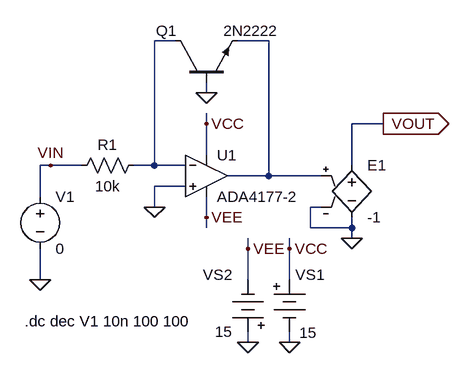
[diagram p0: schematic fig-01-03-21.asc]
fig-01-03-21.asc, the LTspice schematic file:
Version 4
SHEET 1 880 680
WIRE 160 -32 128 -32
WIRE 304 -32 256 -32
WIRE 208 48 208 32
WIRE 208 96 208 80
WIRE 480 96 432 96
WIRE 208 144 208 96
WIRE -32 160 -48 160
WIRE 16 160 -32 160
WIRE 128 160 128 -32
WIRE 128 160 96 160
WIRE 176 160 128 160
WIRE 432 160 432 96
WIRE 304 176 304 -32
WIRE 304 176 240 176
WIRE 384 176 304 176
WIRE 176 192 128 192
WIRE -48 208 -48 160
WIRE 128 224 128 192
WIRE 384 224 368 224
WIRE 208 240 208 208
WIRE 208 256 208 240
WIRE 368 256 368 224
WIRE 432 256 432 240
WIRE 432 256 368 256
WIRE 432 272 432 256
WIRE 272 288 272 272
WIRE 336 288 336 272
WIRE -48 336 -48 288
WIRE 272 336 272 288
WIRE 336 336 336 288
WIRE 272 432 272 416
WIRE 336 432 336 416
FLAG -48 336 0
FLAG -32 160 VIN
FLAG 272 432 0
FLAG 336 432 0
FLAG 272 288 VEE
FLAG 336 288 VCC
FLAG 208 96 VCC
FLAG 208 240 VEE
FLAG 480 96 VOUT
IOPIN 480 96 Out
FLAG 208 48 0
FLAG 128 224 0
FLAG 432 272 0
SYMBOL Misc\\battery 336 320 R0
WINDOW 0 9 8 Left 2
WINDOW 3 15 97 Left 2
SYMATTR InstName VS1
SYMATTR Value 15
SYMBOL Misc\\battery 272 432 R180
WINDOW 0 24 104 Left 2
WINDOW 3 24 16 Left 2
SYMATTR InstName VS2
SYMATTR Value 15
SYMBOL res 112 144 R90
WINDOW 0 0 56 VBottom 2
WINDOW 3 32 56 VTop 2
SYMATTR InstName R1
SYMATTR Value 10k
SYMBOL npn 160 32 R270
WINDOW 0 79 -30 VRight 2
WINDOW 3 79 74 VRight 2
SYMATTR InstName Q1
SYMATTR Value 2N2222
SYMBOL voltage -48 192 R0
SYMATTR InstName V1
SYMATTR Value 0
SYMBOL Opamps\\ADA4177-2 208 176 R0
SYMATTR InstName U1
SYMBOL e 432 144 R0
SYMATTR InstName E1
SYMATTR Value -1
TEXT -72 400 Left 2 !.dc dec V1 10n 100 100

The netlist it stands for:
* fig-01-03-21.asc
VS1 VCC 0 15
VS2 0 VEE 15
R1 N001 VIN 10k
Q1 N001 0 N002 0 2N2222
V1 VIN 0 0
* U1: ADA4177-2 (symbol Opamps\ADA4177-2 not available, pins judged from their places): In+=0 In-=N001 V+=VCC V-=VEE OUT=N002
E1 VOUT 0 N002 0 -1
.model NPN NPN
.model PNP PNP
.lib standard.bjt
.dc dec V1 10n 100 100
.backanno
.end